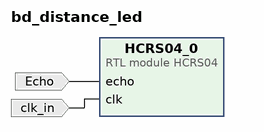
[diagram p0: block diagram of the top level]
# Vivado block design bd_distance_led, xc7z020clg400-1, Vivado 2022.1
create_bd_design bd_distance_led

create_bd_port -dir I clk_in
create_bd_port -dir I Echo

create_bd_cell -type module -reference HCRS04 HCRS04_0

# ---- connections ----

connect_bd_net [get_bd_ports Echo] [get_bd_pins HCRS04_0/echo]
connect_bd_net [get_bd_ports clk_in] [get_bd_pins HCRS04_0/clk]

validate_bd_design
save_bd_design
